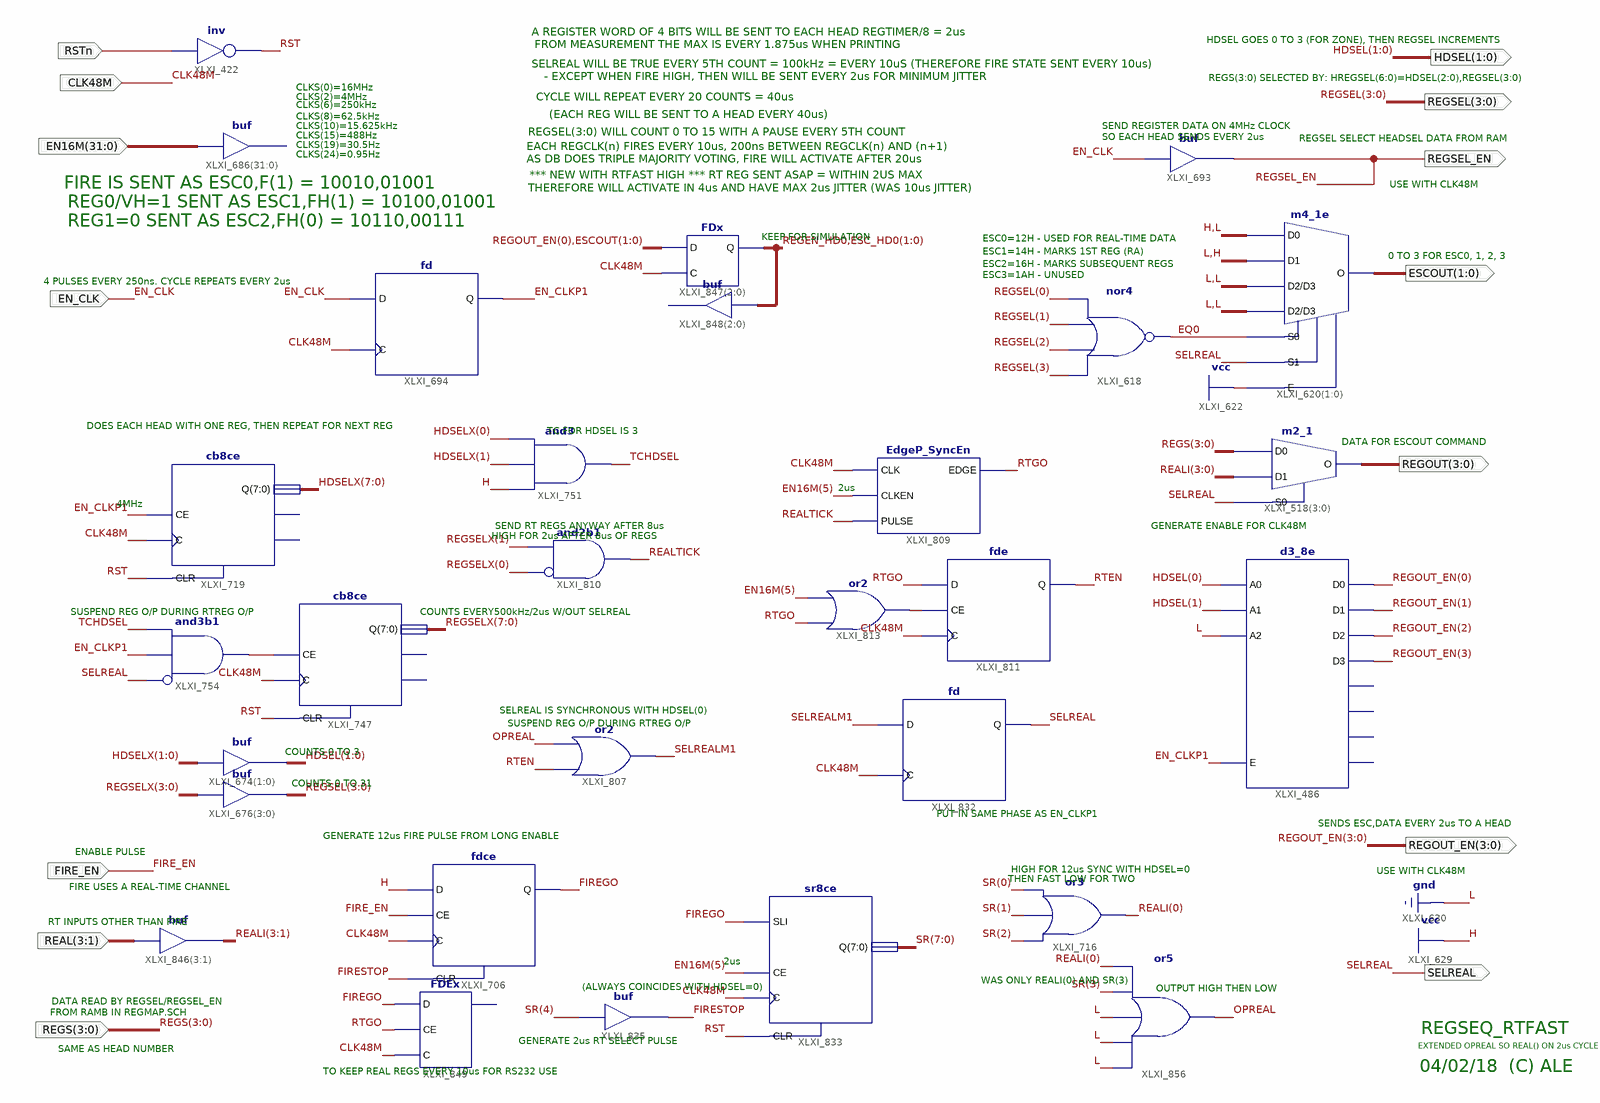
[diagram p0: schematic sheet 1]
// Xilinx ISE schematic RegSeq_RtFast.sch (spartan6) as structural Verilog: 29 symbols, 14 ports
module RegSeq_RtFast (
  input  [3:0] REGS,
  input  CLK48M,
  input  RSTn,
  input  [31:0] EN16M,
  input  EN_CLK,
  input  [3:1] REAL,
  input  FIRE_EN,
  output SELREAL,
  output REGSEL_EN,
  output [3:0] REGSEL,
  output [1:0] ESCOUT,
  output [3:0] REGOUT,
  output [3:0] REGOUT_EN,
  output [1:0] HDSEL
);

  wire EN_CLKP1, EQ0, FIREGO, FIRESTOP, OPREAL, REALTICK, REGEN_HD0, RST, RTEN, RTGO, SELREALM1, TCHDSEL,
       XLXN_1900, XLXN_2115;
  wire [1:0] ESC_HD0;
  wire [3:0] REALI;
  wire [7:0] HDSELX, REGSELX, SR;

  not XLXI_422 (RST, RSTn);
  // buf XLXI_686[31..0] has open pins: I=EN16M, O=open
  buf XLXI_693 (REGSEL_EN, EN_CLK);
  m4_1e XLXI_620[1:0] (.D0(2'b10), .D1(2'b01), .D2(2'b00), .D3(2'b00), .E(1'b1), .S0(EQ0), .S1(SELREAL), .O(ESCOUT));
  nor XLXI_618 (EQ0, REGSEL[3], REGSEL[2], REGSEL[1], REGSEL[0]);
  cb8ce XLXI_719 (.C(CLK48M), .CE(EN_CLKP1), .CLR(RST), .Q(HDSELX));  // open: CEO, TC
  assign HDSEL = HDSELX[1:0];  // buf XLXI_674[1..0], 2 bits wide
  assign REGSEL = REGSELX[3:0];  // buf XLXI_676[3..0], 4 bits wide
  d3_8e XLXI_486 (
    .A0(HDSEL[0]), .A1(HDSEL[1]), .A2(1'b0), .E(EN_CLKP1), .D0(REGOUT_EN[0]), .D1(REGOUT_EN[1]),
    .D2(REGOUT_EN[2]), .D3(REGOUT_EN[3]));  // open: D4, D5, D6, D7
  cb8ce XLXI_747 (.C(CLK48M), .CE(XLXN_1900), .CLR(RST), .Q(REGSELX));  // open: CEO, TC
  and XLXI_754 (XLXN_1900, ~SELREAL, EN_CLKP1, TCHDSEL);  // and3b1
  m2_1 XLXI_518[3:0] (.D0(REGS), .D1(REALI), .S0(SELREAL), .O(REGOUT));
  EdgeP_SyncEn XLXI_809 (.CLK(CLK48M), .CLKEN(EN16M[5]), .EDGE(RTGO), .PULSE(REALTICK));
  or XLXI_813 (XLXN_2115, RTGO, EN16M[5]);
  fde XLXI_811 (.C(CLK48M), .CE(XLXN_2115), .D(RTGO), .Q(RTEN));
  fd XLXI_832 (.C(CLK48M), .D(SELREALM1), .Q(SELREAL));
  and XLXI_751 (TCHDSEL, 1'b1, HDSELX[1], HDSELX[0]);
  and XLXI_810 (REALTICK, ~REGSELX[0], REGSELX[1]);  // and2b1
  or XLXI_807 (SELREALM1, RTEN, OPREAL);
  fd XLXI_694 (.C(CLK48M), .D(EN_CLK), .Q(EN_CLKP1));
  sr8ce XLXI_833 (.C(CLK48M), .CE(EN16M[5]), .CLR(RST), .SLI(FIREGO), .Q(SR));
  or XLXI_716 (REALI[0], SR[2], SR[1], SR[0]);
  assign REALI[3:1] = REAL;  // buf XLXI_846[3..1], 3 bits wide
  FDx XLXI_847[2:0] (.C(CLK48M), .D({REGOUT_EN[0], ESCOUT}), .Q({REGEN_HD0, ESC_HD0}));
  // buf XLXI_848[2..0] has open pins: I={REGEN_HD0, ESC_HD0}, O=open
  fdce XLXI_706 (.C(CLK48M), .CE(FIRE_EN), .CLR(FIRESTOP), .D(1'b1), .Q(FIREGO));
  FDEx XLXI_849 (.C(CLK48M), .CE(RTGO), .D(FIREGO));  // open: Q
  buf XLXI_835 (FIRESTOP, SR[4]);
  or XLXI_856 (OPREAL, 1'b0, 1'b0, 1'b0, SR[3], REALI[0]);

  // Notes on the sheet:
  //   A REGISTER WORD OF 4 BITS WILL BE SENT TO EACH HEAD REGTIMER/8 = 2us
  //   HDSEL GOES 0 TO 3 (FOR ZONE), THEN REGSEL INCREMENTS
  //   FROM MEASUREMENT THE MAX IS EVERY 1.875us WHEN PRINTING
  //   SELREAL WILL BE TRUE EVERY 5TH COUNT = 100kHz = EVERY 10uS (THEREFORE FIRE STATE SENT EVERY 10us)
  //   - EXCEPT WHEN FIRE HIGH, THEN WILL BE SENT EVERY 2us FOR MINIMUM JITTER
  //   REGS(3:0) SELECTED BY: HREGSEL(6:0)=HDSEL(2:0),REGSEL(3:0)
  //   CLKS(0)=16MHz
  //   CLKS(2)=4MHz
  //   CYCLE WILL REPEAT EVERY 20 COUNTS = 40us
  //   CLKS(6)=250kHz
  //   (EACH REG WILL BE SENT TO A HEAD EVERY 40us)
  //   CLKS(8)=62.5kHz
  //   CLKS(10)=15.625kHz
  //   SEND REGISTER DATA ON 4MHz CLOCK
  //   REGSEL(3:0) WILL COUNT 0 TO 15 WITH A PAUSE EVERY 5TH COUNT
  //   CLKS(15)=488Hz
  //   SO EACH HEAD SENDS EVERY 2us
  //   REGSEL SELECT HEADSEL DATA FROM RAM
  //   CLKS(19)=30.5Hz
  //   EACH REGCLK(n) FIRES EVERY 10us, 200ns BETWEEN REGCLK(n) AND (n+1)
  //   CLKS(24)=0.95Hz
  //   AS DB DOES TRIPLE MAJORITY VOTING, FIRE WILL ACTIVATE AFTER 20us
  //   *** NEW WITH RTFAST HIGH *** RT REG SENT ASAP = WITHIN 2US MAX
  //   FIRE IS SENT AS ESC0,F(1) = 10010,01001
  //   USE WITH CLK48M
  //   THEREFORE WILL ACTIVATE IN 4us AND HAVE MAX 2us JITTER (WAS 10us JITTER)
  //   REG0/VH=1 SENT AS ESC1,FH(1) = 10100,01001
  //   REG1=0 SENT AS ESC2,FH(0) = 10110,00111
  //   KEEP FOR SIMULATION
  //   ESC0=12H - USED FOR REAL-TIME DATA
  //   ESC1=14H - MARKS 1ST REG (RA)
  //   0 TO 3 FOR ESC0, 1, 2, 3
  //   ESC2=16H - MARKS SUBSEQUENT REGS
  //   ESC3=1AH - UNUSED
  //   4 PULSES EVERY 250ns. CYCLE REPEATS EVERY 2us
  //   DOES EACH HEAD WITH ONE REG, THEN REPEAT FOR NEXT REG
  //   TC FOR HDSEL IS 3
  //   DATA FOR ESCOUT COMMAND
  //   2us
  //   4MHz
  //   SEND RT REGS ANYWAY AFTER 8us
  //   GENERATE ENABLE FOR CLK48M
  //   HIGH FOR 2us AFTER 8us OF REGS
  //   SUSPEND REG O/P DURING RTREG O/P
  //   COUNTS EVERY500kHz/2us W/OUT SELREAL
  //   SELREAL IS SYNCHRONOUS WITH HDSEL(0)
  //   SUSPEND REG O/P DURING RTREG O/P
  //   COUNTS 0 TO 3
  //   COUNTS 0 TO 31
  //   PUT IN SAME PHASE AS EN_CLKP1
  //   SENDS ESC,DATA EVERY 2us TO A HEAD
  //   GENERATE 12us FIRE PULSE FROM LONG ENABLE
  //   ENABLE PULSE
  //   HIGH FOR 12us SYNC WITH HDSEL=0
  //   USE WITH CLK48M
  //   THEN FAST LOW FOR TWO
  //   FIRE USES A REAL-TIME CHANNEL
  //   RT INPUTS OTHER THAN FIRE
  //   2us
  //   WAS ONLY REALI(0) AND SR(3)
  //   (ALWAYS COINCIDES WITH HDSEL=0)
  //   OUTPUT HIGH THEN LOW
  //   DATA READ BY REGSEL/REGSEL_EN
  //   FROM RAMB IN REGMAP.SCH
  //   REGSEQ_RTFAST
  //   GENERATE 2us RT SELECT PULSE
  //   EXTENDED OPREAL SO REAL() ON 2us CYCLE
  //   SAME AS HEAD NUMBER
  //   04/02/18  (C) ALE
  //   TO KEEP REAL REGS EVERY 10us FOR RS232 USE
endmodule
